# Altium schematic sheet peripherals.SchDoc
size A4; SheetNumber: 2; SheetTotal: 2
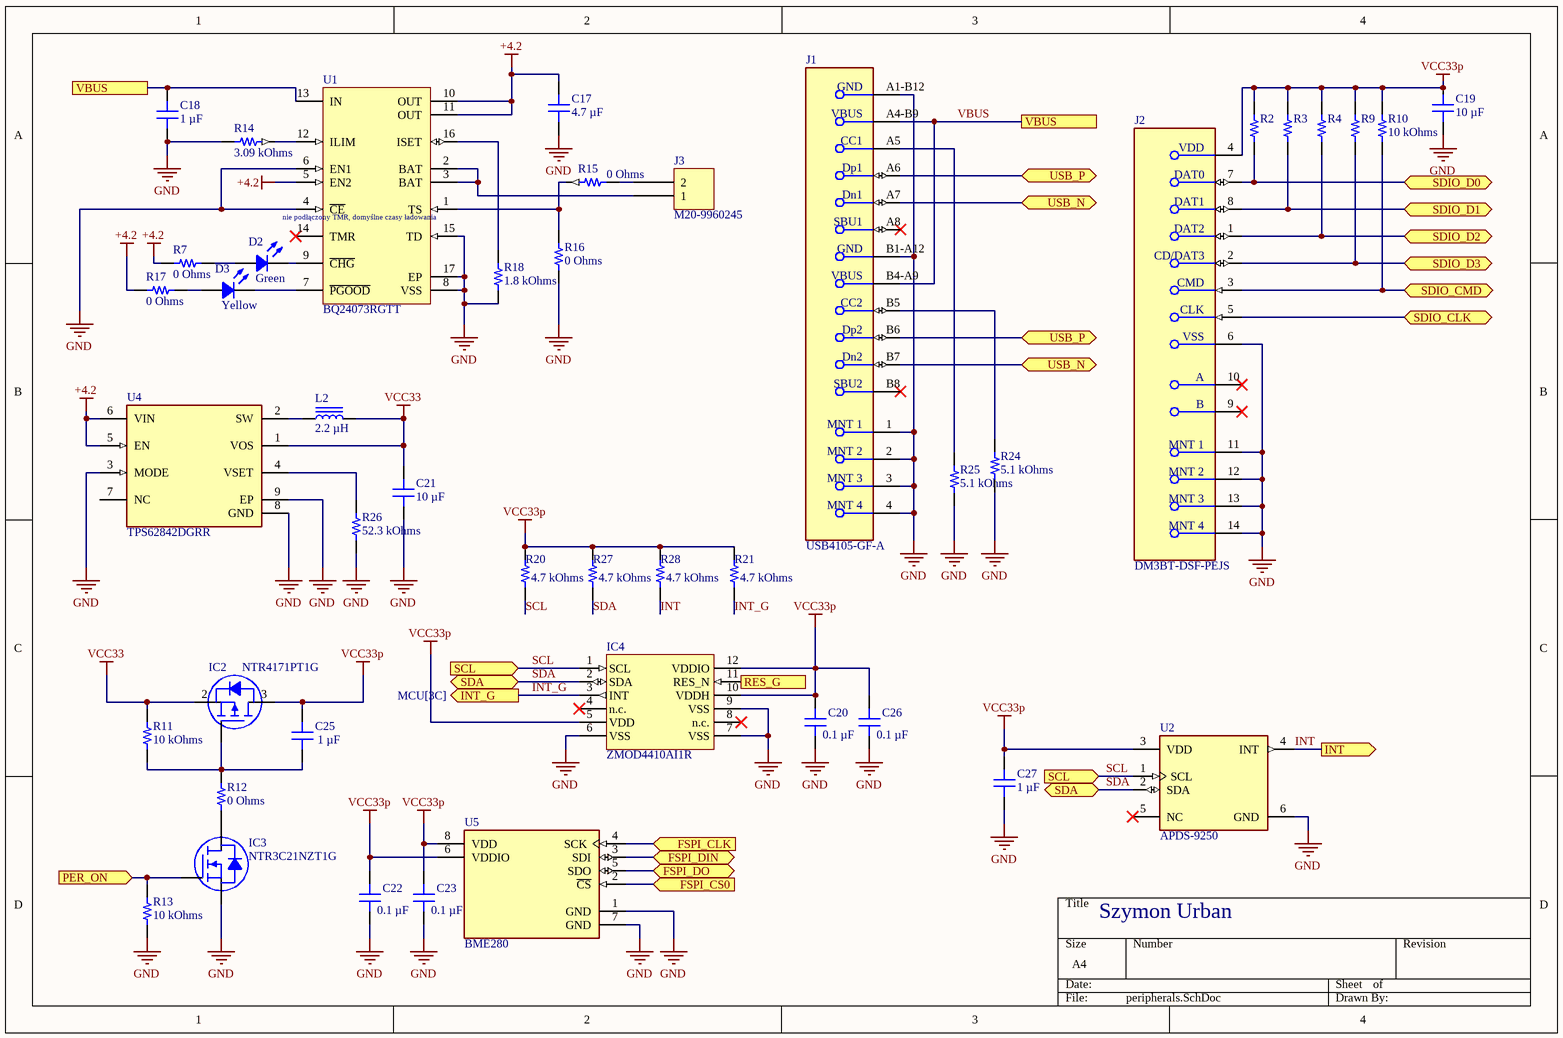
[diagram p0: peripherals.SchDoc]

## Parts
C17  4.7 µF  [CAP 0603_1608]
C18  1 µF  [CAP 0603_1608]
C19  10 µF  [CAP 0603_1608]
C20  0.1 µF  [CAP 0603_1608]
C21  10 µF  [CAP 0603_1608]
C22  0.1 µF  [CAP 0603_1608]
C23  0.1 µF  [CAP 0603_1608]
C25  1 µF  [CAP 0603_1608]
C26  0.1 µF  [CAP 0603_1608]
C27  1 µF  [CAP 0603_1608]
D2  Green  [LED 0805_2012 GREEN]
D3  Yellow  [LED 0805_2012 YELLOW]
IC2  NTR4171PT1G  [ON SEMI SOT-23-3]
IC3  NTR3C21NZT1G  [ON SEMI SOT-23-3]
IC4  ZMOD4410AI1R  [ZMODxxxx 12 Leads- LGG12]
J1  USB4105-GF-A  [FP-USB4105-GF-A-MFG]
J2  DM3BT-DSF-PEJS  [FP-DM3BT-DSF-PEJS-MFG]
J3  M20-9960245  [HARWIN M20-9960245]
L2  2.2 µH  [IND 0806_2016]
R2  10 kOhms  [RES 0603_1608]  (value not drawn)
R3  10 kOhms  [RES 0603_1608]  (value not drawn)
R4  10 kOhms  [RES 0603_1608]  (value not drawn)
R7  0 Ohms  [RES 0603_1608]
R9  10 kOhms  [RES 0603_1608]  (value not drawn)
R10  10 kOhms  [RES 0603_1608]
R11  10 kOhms  [RES 0603_1608]
R12  0 Ohms  [RES 0603_1608]
R13  10 kOhms  [RES 0603_1608]
R14  3.09 kOhms  [RES 0603_1608]
R15  0 Ohms  [RES 0603_1608]
R16  0 Ohms  [RES 0603_1608]
R17  0 Ohms  [RES 0603_1608]
R18  1.8 kOhms  [RES 0603_1608]
R20  4.7 kOhms  [RES 0603_1608]
R21  4.7 kOhms  [RES 0603_1608]
R24  5.1 kOhms  [RES 0603_1608]
R25  5.1 kOhms  [RES 0603_1608]
R26  52.3 kOhms  [RES 0603_1608]
R27  4.7 kOhms  [RES 0603_1608]
R28  4.7 kOhms  [RES 0603_1608]
U1  BQ24073RGTT  [RGT0016C_V]
U2  APDS-9250  [FP-APDS-9250-MFG]
U4  TPS62842DGRR  [FP-DGR0008A-MFG]
U5  BME280  [FP-BME280-MFG]

## Ports
FSPI_CLK (in, see MCU[1D]), FSPI_CS0 (in, see MCU[3C]), FSPI_DIN (bidir, see MCU[1C]), FSPI_DO (bidir, see MCU[1D]), INT (out, see MCU[1D]), INT_G (out, see MCU[3C]), PER_ON (in, see MCU[3C]), RES_G (in, see MCU[3C]), SCL (in, see MCU[1D], peripherals[2C]), SCL (in, see MCU[1D], peripherals[3D]), SDA (bidir, see MCU[1D], peripherals[2C]), SDA (bidir, see MCU[1D], peripherals[3D]), SDIO_CLK (bidir, see MCU[3B]), SDIO_CMD (bidir, see MCU[3B]), SDIO_D0 (bidir, see MCU[3B]), SDIO_D1 (bidir, see MCU[3B]), SDIO_D2 (bidir, see MCU[3B]), SDIO_D3 (bidir, see MCU[3A]), USB_N (bidir, see MCU[1D], peripherals[3A]), USB_N (bidir, see MCU[1D], peripherals[3B]), USB_P (bidir, see MCU[3C], peripherals[3A]), USB_P (bidir, see MCU[3C], peripherals[3B]), VBUS (see MCU[1D], peripherals[1A]), VBUS (see MCU[1D], peripherals[3A])

## Nets
+4.2: C17.2 R7.2 R17.2 U1.5(EN2) U1.10(OUT) U1.11(OUT) U4.5(EN) U4.6(VIN)
GND: C17.1 C18.1 C19.2 C20.1 C21.2 C22.1 C23.1 C26.1 C27.1 IC3.2(S) IC4.6(VSS) IC4.7(VSS) IC4.9(VSS) J1.1(MNT_1) J1.2(MNT_2) J1.3(MNT_3) J1.4(MNT_4) J1.A1-B12(GND) J1.B1-A12(GND) J2.6(VSS) J2.11(MNT_1) J2.12(MNT_2) J2.13(MNT_3) J2.14(MNT_4) R13.1 R14.1 R16.1 R18.1 R24.1 R25.1 R26.1 U1.4(~{CE}) U1.6(EN1) U1.8(VSS) U1.15(TD) U1.17(EP) U2.6(GND) U4.3(MODE) U4.8(GND) U4.9(EP) U5.1(GND) U5.7(GND)
VCC33: C21.1 IC2.2(S) L2.2 R11.2 U4.1(VOS)
VCC33p: C19.1 C20.2 C22.2 C23.2 C25.2 C26.2 C27.2 IC2.3(D) IC4.5(VDD) IC4.10(VDDH) IC4.12(VDDIO) J2.4(VDD) R2.2 R3.2 R4.2 R9.2 R10.2 R20.1 R21.1 R27.1 R28.1 U2.3(VDD) U5.6(VDDIO) U5.8(VDD)
FSPI_CLK: U5.4(SCK) ; port FSPI_CLK
FSPI_CS0: U5.2(~{CS}) ; port FSPI_CS0
FSPI_DIN: U5.3(SDI) ; port FSPI_DIN
FSPI_DO: U5.5(SDO) ; port FSPI_DO
INT: R28.2 U2.4(INT) ; port INT
INT_G: IC4.3(INT) R21.2 ; port INT_G
PER_ON: IC3.1(G) R13.2 ; port PER_ON
RES_G: IC4.11(RES_N) ; port RES_G
SCL: IC4.1(SCL) R20.2 U2.1(SCL) ; port SCL
SDA: IC4.2(SDA) R27.2 U2.2(SDA) ; port SDA
SDIO_CLK: J2.5(CLK) ; port SDIO_CLK
SDIO_CMD: J2.3(CMD) R10.1 ; port SDIO_CMD
SDIO_D0: J2.7(DAT0) R2.1 ; port SDIO_D0
SDIO_D1: J2.8(DAT1) R3.1 ; port SDIO_D1
SDIO_D2: J2.1(DAT2) R4.1 ; port SDIO_D2
SDIO_D3: J2.2(CD/DAT3) R9.1 ; port SDIO_D3
USB_N: J1.A7(Dn1) J1.B7(Dn2) ; port USB_N
USB_P: J1.A6(Dp1) J1.B6(Dp2) ; port USB_P
VBUS: C18.2 J1.A4-B9(VBUS) J1.B4-A9(VBUS) U1.13(IN) ; port VBUS
NetC25_1: C25.1 IC2.1(G) R11.1 R12.2
NetD2_1: D2.1 R7.1
NetD2_2: D2.2 U1.9(~{CHG})
NetD3_1: D3.1 R17.1
NetD3_2: D3.2 U1.7(~{PGOOD})
NetIC3_3: IC3.3(D) R12.1
NetJ1_A5: J1.A5(CC1) R25.2
NetJ1_B5: J1.B5(CC2) R24.2
NetJ3_1: J3.1 U1.2(BAT) U1.3(BAT)
NetJ3_2: J3.2 R15.2
NetL2_1: L2.1 U4.2(SW)
NetR14_2: R14.2 U1.12(ILIM)
NetR15_1: R15.1 R16.2 U1.1(TS)
NetR18_2: R18.2 U1.16(ISET)
NetR26_2: R26.2 U4.4(VSET)

Not connected (* = marked no-connect by the designer): IC4 4(n.c.)* 8(n.c.)*; J1 A8(SBU1)* B8(SBU2)*; J2 9(B)* 10(A)*; U1 14(TMR)*; U2 5(NC)*; U4 7(NC)

## Notes on the sheet
- (near U1) nie podłączony TMR, domyślne czasy ładowania
- Szymon Urban

## Library data of the parts
C17 = GRM188R61C475KE11D: CAP CER 4.7UF 16V X5R 0603; manufacturer: Murata Electronics; Tolerance: ±10%; Part Number: GRM188R61C475KE11D; Value: 4.7 µF; Applications: General Purpose; Capacitance: 4.7 µF; componentlink1description: Datasheet; componentlink1url: https://search.murata.co.jp/Ceramy/image/img/A01X/G101/ENG/GRM188R61C475KE11-01.pdf; componentlink2description: DigiKey Link; componentlink2url: https://www.digikey.com/en/products/detail/murata-electronics/GRM188R61C475KE11D/4905341; Device Package: 0603 (1608 Metric); lastupdated: 15.01.2024 20:10:04; Lifecycle Status: Active; Minimum Order: 1; Mounting Type: Surface Mount, MLCC; Operating Temperature: -55°C ~ 85°C; Package / Case: 0603 (1608 Metric); packaging: TapeAndReel; partid: 2388; Part Status: Active; price: 0.03; series: GRM; Size / Dimension: 0.063" L x 0.031" W (1.60mm x 0.80mm); Supplier 1: DigiKey; Supplier Part Number 1: 490-10730-1-ND; Temperature Coefficient: X5R; Thickness (Max): 0.037" (0.95mm); Voltage - Rated: 16V
C18 C25 C27 = CC0603KRX7R6BB105: CAP CER 1UF 10V X7R 0603; manufacturer: Yageo; Tolerance: ±10%; Part Number: CC0603KRX7R6BB105; Value: 1 µF; Applications: General Purpose; Capacitance: 1 µF; componentlink1description: Datasheet; componentlink1url: https://www.yageo.com/upload/media/product/productsearch/datasheet/mlcc/UPY-GPHC_X7R_6.3V-to-50V_18.pdf; componentlink2description: DigiKey Link; componentlink2url: https://www.digikey.com/en/products/detail/yageo/CC0603KRX7R6BB105/5195204; Device Package: 0603 (1608 Metric); lastupdated: 15.01.2024 20:10:05; Lifecycle Status: Active; Minimum Order: 1; Mounting Type: Surface Mount, MLCC; Operating Temperature: -55°C ~ 125°C; Package / Case: 0603 (1608 Metric); packaging: TapeAndReel; partid: 2290; Part Status: Active; price: 0.01; series: CC; Size / Dimension: 0.063" L x 0.031" W (1.60mm x 0.80mm); Supplier 1: DigiKey; Supplier Part Number 1: 311-1796-1-ND; Temperature Coefficient: X7R; Thickness (Max): 0.035" (0.90mm); Voltage - Rated: 10V
C19 C21 = GRM188D71A106KA73D: CAP CER 10UF 10V X7T 0603; manufacturer: Murata Electronics; Tolerance: ±10%; Part Number: GRM188D71A106KA73D; Value: 10 µF; Applications: General Purpose; Capacitance: 10 µF; componentlink1description: Datasheet; componentlink1url: https://search.murata.co.jp/Ceramy/image/img/A01X/G101/ENG/GRM188D71A106KA73-01.pdf; componentlink2description: DigiKey Link; componentlink2url: https://www.digikey.com/en/products/detail/murata-electronics/GRM188D71A106KA73D/6606090; Device Package: 0603 (1608 Metric); lastupdated: 15.01.2024 20:10:04; Lifecycle Status: Active; Minimum Order: 1; Mounting Type: Surface Mount, MLCC; Operating Temperature: -55°C ~ 125°C; Package / Case: 0603 (1608 Metric); packaging: TapeAndReel; partid: 2489; Part Status: Active; price: 0.03; series: GRM; Size / Dimension: 0.063" L x 0.031" W (1.60mm x 0.80mm); Supplier 1: DigiKey; Supplier Part Number 1: 490-14461-1-ND; Temperature Coefficient: X7T; Thickness (Max): 0.039" (1.00mm); Voltage - Rated: 10V
C20 C22 C23 C26 = CS0603KRX7R7BB104: CAP CER 0.1UF 16V X7R 0603; manufacturer: Yageo; Tolerance: ±10%; Part Number: CS0603KRX7R7BB104; Value: 0.1 µF; Applications: Boardflex Sensitive; Capacitance: 0.1 µF; componentlink1description: Datasheet; componentlink1url: http://www.yageo.com/NewPortal/yageodocoutput?fileName=/pdf/MLCC/UPY-ST_NPOX7R_16V-to-3KV_5.pdf; componentlink2description: DigiKey Link; componentlink2url: https://www.digikey.com/en/products/detail/yageo/CS0603KRX7R7BB104/6097897; Device Package: 0603 (1608 Metric); Features: Soft Termination; lastupdated: 15.01.2024 20:10:05; Lifecycle Status: Active; Minimum Order: 1; Mounting Type: Surface Mount, MLCC; Operating Temperature: -55°C ~ 125°C; Package / Case: 0603 (1608 Metric); packaging: TapeAndReel; partid: 2286; Part Status: Active; price: 0.01; series: CS; Size / Dimension: 0.063" L x 0.031" W (1.60mm x 0.80mm); Supplier 1: DigiKey; Supplier Part Number 1: 311-3560-1-ND; Temperature Coefficient: X7R; Thickness (Max): 0.037" (0.95mm); Voltage - Rated: 16V
D2 = 150080VS75000: LED GREEN CLEAR 0805 SMD; Manufacturer: Würth Elektronik; Configuration: Standard; Current - Test: 20mA; Lens Color: Colorless; Lens Size: 1.40mm x 1.25mm; Lens Style: Rectangle with Flat Top; Millicandela Rating: 40mcd; Viewing Angle: 140°; Voltage - Forward (Vf) (Typ): 2V; Wavelength - Dominant: 570nm; Wavelength - Peak: 572nm; Part Number: 150080VS75000; Color: Green; ComponentLink1Description: Datasheet; ComponentLink1URL: https://katalog.we-online.de/led/datasheet/150080VS75000.pdf; ComponentLink2Description: DigiKey Link; ComponentLink2URL: https://www.digikey.com/en/products/detail/würth-elektronik/150080VS75000/4489924; Device Package: 0805 (2012 Metric); Height (Max): 0.80mm; LastUpdated: 15.01.2024 21:31:06; Lens Transparency: Clear; Lifecycle Status: Active; Minimum Order: 1; Mounting Type: Surface Mount; Package / Case: 0805 (2012 Metric); Packaging: TapeAndReel; PartId: 300; Part Status: Active; Price: 0.13; Series: WL-SMCW; Size / Dimension: 2.00mm L x 1.25mm W; Supplier 1: DigiKey; Supplier Part Number 1: 732-4986-1-ND; Supplier Device Package: 0805; Value: Green
D3 = 150080YS75000: LED YELLOW CLEAR 0805 SMD; Manufacturer: Würth Elektronik; Configuration: Standard; Current - Test: 20mA; Lens Color: Colorless; Lens Size: 1.40mm x 1.25mm; Lens Style: Rectangle with Flat Top; Millicandela Rating: 120mcd; Viewing Angle: 140°; Voltage - Forward (Vf) (Typ): 2V; Wavelength - Dominant: 590nm; Wavelength - Peak: 595nm; Part Number: 150080YS75000; Color: Yellow; ComponentLink1Description: Datasheet; ComponentLink1URL: https://katalog.we-online.de/led/datasheet/150080YS75000.pdf; ComponentLink2Description: DigiKey Link; ComponentLink2URL: https://www.digikey.com/en/products/detail/würth-elektronik/150080YS75000/4489927; Device Package: 0805 (2012 Metric); Height (Max): 0.80mm; LastUpdated: 15.01.2024 21:32:02; Lens Transparency: Clear; Lifecycle Status: Active; Minimum Order: 1; Mounting Type: Surface Mount; Package / Case: 0805 (2012 Metric); Packaging: TapeAndReel; PartId: 56; Part Status: Active; Price: 0.13; Series: WL-SMCW; Size / Dimension: 2.00mm L x 1.25mm W; Supplier 1: DigiKey; Supplier Part Number 1: 732-4987-1-ND; Supplier Device Package: 0805; Value: Yellow
IC2 = NTR4171PT1G: MOSFET P-CH 30V 2.2A SOT23; Manufacturer: ON Semiconductor; Current - Continuous Drain (Id) @ 25°C: 2.2A (Ta); Drive Voltage (Max Rds On,  Min Rds On): 2.5V, 10V; FET Type: P-Channel; Gate Charge (Qg) (Max) @ Vgs: 15.6nC @ 10V; Input Capacitance (Ciss) (Max) @ Vds: 720pF @ 15V; Power Dissipation (Max): 480mW (Ta); Rds On (Max) @ Id, Vgs: 75mOhm @ 2.2A, 10V; Vgs (Max): ±12V; Vgs(th) (Max) @ Id: 1.4V @ 250µA; Part Number: NTR4171PT1G; ComponentLink1Description: Datasheet; ComponentLink1URL: http://www.onsemi.com/pub/Collateral/NTR4171P-D.PDF; ComponentLink2Description: DigiKey Link; ComponentLink2URL: http://digikey.com/product-detail/en/on-semiconductor/NTR4171PT1G/NTR4171PT1GOSCT-ND/2705209; Drain to Source Voltage (Vdss): 30V; LastUpdated: 08.02.2024 21:46:19; Lifecycle Status: Active; Minimum Order: 1; Mounting Type: Surface Mount; Operating Temperature: -55°C ~ 150°C (TJ); Package / Case: TO-236-3, SC-59, SOT-23-3; Packaging: TapeAndReel; Part Status: Active; Price: 0.10; Series: -; Supplier 1: DigiKey; Supplier Part Number 1: NTR4171PT1GOSCT-ND; Supplier Device Package: SOT-23-3 (TO-236); Technology: MOSFET (Metal Oxide)
IC3 = NTR3C21NZT1G: MOSFET N-CH 20V 3.6A SOT23-3; Manufacturer: ON Semiconductor; Current - Continuous Drain (Id) @ 25°C: 3.6A (Ta); Drive Voltage (Max Rds On,  Min Rds On): 1.8V, 4.5V; FET Type: N-Channel; Gate Charge (Qg) (Max) @ Vgs: 17.8nC @ 4.5V; Input Capacitance (Ciss) (Max) @ Vds: 1540pF @ 16V; Power Dissipation (Max): 470mW (Ta); Rds On (Max) @ Id, Vgs: 24mOhm @ 5A, 4.5V; Vgs (Max): ±8V; Vgs(th) (Max) @ Id: 1V @ 250µA; Part Number: NTR3C21NZT1G; ComponentLink1Description: Datasheet; ComponentLink1URL: http://www.onsemi.com/pub/Collateral/NTR3C21NZ-D.PDF; ComponentLink2Description: DigiKey Link; ComponentLink2URL: http://digikey.com/product-detail/en/on-semiconductor/NTR3C21NZT1G/NTR3C21NZT1GOSCT-ND/9087577; Drain to Source Voltage (Vdss): 20V; LastUpdated: 08.02.2024 21:46:18; Lifecycle Status: Active; Minimum Order: 1; Mounting Type: Surface Mount; Operating Temperature: -55°C ~ 150°C (TJ); Package / Case: TO-236-3, SC-59, SOT-23-3; Packaging: TapeAndReel; Part Status: Active; Price: 0.10; Series: -; Supplier 1: DigiKey; Supplier Part Number 1: NTR3C21NZT1GOSCT-ND; Supplier Device Package: SOT-23-3 (TO-236); Technology: MOSFET (Metal Oxide)
IC4 = CMP-13577-000002-2: TVOC IAQ INTEGRATED SENSOR; NexarPartId: 106944004; Min Supply Voltage: 1.7V; Max Supply Voltage: 3.6V; Width: 3mm; Min Operating Temperature: -40°C; Max Operating Temperature: 65°C; RoHS: Non-Compliant; Height: 770µm; Thickness: 700µm; Length: 3mm; Ambient Temperature Range High: 65°C; Number of Pins: 12
J1 = CMP-245163-000001-1: CONN RCPT USB2.0 TYPEC 5A; Manufacturer: GCT; Voltage Rating: 20V; Is Female: yes; Current Rating: 5/6.25/1.25/0.25A; Number Of Contacts: 16; Conn Orientation: Right Angle; Device Class L1: Connectors; Category: Conn; Lead Free: Yes; RoHS: TRUE; Temperature Range High: +85°C; Digikey Description: CONN RCPT USB2.0 TYPEC 5A; Device Class L3: unset; ComponentLink2Description: Datasheet; Manufacturer Part Number: USB4105-GF-A; Package: 0; Usb Standard: USB 2.0; Device Class L2: USB Connectors; Automotive: No; Temperature Range Low: -40°C; Height: 3.46mm; Temperature: -40°C to +85°C; Contact Material: Gold,Nickel; ComponentLink2URL: https://gct.co/files/drawings/usb4105.pdf; Octopart: https://octopart.com/usb4105-gf-a-gct-106627878
J2 = CMP-11597-000004-1: CONN MICRO SD CARD PUSH-PUSH R/A; Connector Type: Connector; Pitch: 1.1mm; Insulation Resistance: 1GR; Contact Resistance: 100mR; Number of Positions: 8; Max Voltage Rating (AC): 125V; Gender: Female; Current Rating: 500mA; Flammability Rating: UL94 V-0; Min Operating Temperature: -25°C; Lead Free: Lead Free; Length: 13.85mm; Radiation Hardening: No; Orientation: Right Angle; Mount: Surface Mount; Housing Material: Polymer; Contact Material: Copper Alloy; Package Quantity: 1; Contact Plating: Gold; Termination: Solder; Max Operating Temperature: 85°C; Number of Contacts: 8; Voltage Rating (AC): 125V; REACH SVHC: No SVHC; Depth: 1.83mm; Max Current Rating: 500mA; Width: 16.05mm; Number of Rows: 1; Packaging: Tape and Reel
J3 = M20-9960245: CONN HEADER R/A 2POS 2.54MM; Manufacturer: Harwin Inc.; Connector Type: Header, Cuttable; Contact Length - Mating: 0.240" (6.10mm); Contact Length - Post: 0.118" (3.00mm); Current Rating (Amps): 3A per Contact; Material Flammability Rating: UL94 V-0; Number of Positions: 2; Number of Positions Loaded: All; Pitch - Mating: 0.100" (2.54mm); Row Spacing - Mating: -40°C ~ 105°C; Shrouding: Unshrouded; Style: Board to Board or Cable; Part Number: M20-9960245; ComponentLink1Description: Datasheet; ComponentLink1URL: https://cdn.harwin.com/pdfs/Harwin_PC_Connectors_M20.pdf; ComponentLink2Description: DigiKey Link; ComponentLink2URL: https://www.digikey.com/en/products/detail/harwin-inc/M20-9960245/3728208; Contact Finish - Mating: Gold; Contact Material: Brass; Contact Shape: Square; Contact Type: Male Pin; Fastening Type: Push-Pull; Insulation Color: Black; Insulation Height: 0.100" (2.54mm); Insulation Material: Polyamide (PA6T), Nylon 6T; LastUpdated: 21.09.2022 19:22:55; Lifecycle Status: Active; Minimum Order: 1; Mounting Type: Through Hole, Right Angle; Number of Rows: 1; Operating Temperature: -40°C ~ 105°C; Packaging: Bulk; PartId: 165; Part Status: Active; Price: 0.07; Series: M20; Supplier 1: DigiKey; Supplier Part Number 1: 952-2244-ND; Termination: Solder
L2 = DFE201612E-2R2M=P2: FIXED IND 2.2UH 1.8A 116MOHM SMD; Manufacturer: Murata Electronics; DC Resistance (DCR): 116mOhm Max; Inductance Frequency - Test: 1 MHz; Material - Core: Metal; Shielding: Shielded; Tolerance: ±20%; Type: Drum Core, Wirewound; Part Number: DFE201612E-2R2M=P2; ComponentLink1Description: Datasheet; ComponentLink1URL: https://search.murata.co.jp/Ceramy/image/img/P02/J(E)TE243A-0006.pdf; ComponentLink2Description: DigiKey Link; ComponentLink2URL: https://www.digikey.com/en/products/detail/murata-electronics/DFE201612E-2R2M-P2/9815901; Current Rating (Amps): 1.8 A; Device Package: 0806 (2016 Metric); Height - Seated (Max): 0.047" (1.20mm); Inductance: 2.2 µH; LastUpdated: 08.02.2024 21:45:16; Lifecycle Status: Active; Minimum Order: 1; Mounting Type: Surface Mount; Operating Temperature: -40°C ~ 125°C; Package / Case: 0806 (2016 Metric); Packaging: TapeAndReel; PartId: 5399; Part Status: Active; Price: 0.11; Series: DFE201612E; Size / Dimension: 0.079" L x 0.063" W (2.00mm x 1.60mm); Supplier 1: DigiKey; Supplier Part Number 1: 490-DFE201612E-2R2M=P2CT-ND; Supplier Device Package: 0806; Value: 2.2 µH
R2-R4 R9 R10 = RT0603FRE0710KL: RES SMD 10K OHM 1% 1/10W 0603; Manufacturer: Yageo; Power (Watts): 0.1W, 1/10W; Temperature Coefficient: ±50ppm/°C; Part Number: RT0603FRE0710KL; Value: 10 kOhms; ComponentLink1Description: Datasheet; ComponentLink1URL: https://www.yageo.com/upload/media/product/productsearch/datasheet/rchip/PYu-RT_1-to-0.01_RoHS_L_11.pdf; ComponentLink2Description: DigiKey Link; ComponentLink2URL: https://www.digikey.com/en/products/detail/yageo/RT0603FRE0710KL/1075040; Composition: Thin Film; Device Package: 0603 (1608 Metric); Height - Seated (Max): 0.022" (0.55mm); LastUpdated: 15.01.2024 20:40:25; Lifecycle Status: Active; Minimum Order: 1; Number of Terminations: 2; Operating Temperature: -55°C ~ 155°C; Package / Case: 0603 (1608 Metric); Packaging: TapeAndReel; PartId: 5671; Part Status: Active; Price: 0.01; Resistance: 10 kOhms; Series: RT; Size / Dimension: 0.063" L x 0.031" W (1.60mm x 0.80mm); Supplier 1: DigiKey; Supplier Part Number 1: YAG2321CT-ND; Supplier Device Package: 0603; Tolerance: ±1%
R7 R12 R15-R17 = JR0603X26E: 0603 26 AMP JUMPER; Manufacturer: Ohmite; Power (Watts): 0.135W; Part Number: JR0603X26E; Value: 0 Ohms; ComponentLink1Description: Datasheet; ComponentLink1URL: https://www.ohmite.com/assets/docs/res_jr.pdf?r=false; ComponentLink2Description: DigiKey Link; ComponentLink2URL: https://www.digikey.com/en/products/detail/ohmite/JR0603X26E/10233371; Composition: Metal Element; Device Package: 0603 (1608 Metric); Height - Seated (Max): 0.022" (0.55mm); LastUpdated: 15.01.2024 20:40:20; Lifecycle Status: Active; Minimum Order: 1; Number of Terminations: 2; Operating Temperature: -55°C ~ 150°C; Package / Case: 0603 (1608 Metric); Packaging: TapeAndReel; PartId: 6812; Part Status: Active; Price: 0.10; Resistance: 0 Ohms; Series: JR; Size / Dimension: 0.063" L x 0.031" W (1.60mm x 0.80mm); Supplier 1: DigiKey; Supplier Part Number 1: JR0603X26ECT-ND; Supplier Device Package: 0603; Tolerance: Jumper
R11 R13 = TNPW060310K0FHTA: RES 10K OHM 1% 1/10W 0603; Manufacturer: Vishay Dale; Power (Watts): 0.1W, 1/10W; Temperature Coefficient: ±50ppm/°C; Part Number: TNPW060310K0FHTA; Value: 10 kOhms; ComponentLink2Description: DigiKey Link; ComponentLink2URL: https://www.digikey.com/en/products/detail/vishay-dale/TNPW060310K0FHTA/7354881; Composition: Thin Film; Device Package: 0603 (1608 Metric); Features: Military; Height - Seated (Max): 0.022" (0.55mm); LastUpdated: 09.02.2024 20:43:19; Lifecycle Status: Active; Minimum Order: 1; Number of Terminations: 2; Operating Temperature: -55°C ~ 125°C; Package / Case: 0603 (1608 Metric); Packaging: TapeAndReel; PartId: 9361; Part Status: Active; Price: 0.09; Resistance: 10 kOhms; Series: TNPW; Size / Dimension: 0.063" L x 0.033" W (1.60mm x 0.85mm); Supplier 1: DigiKey; Supplier Part Number 1: 541-3906-1-ND; Supplier Device Package: 0603; Tolerance: ±1%
R14 = RMCF0603FT3K09: RES 3.09K OHM 1% 1/10W 0603; Manufacturer: Stackpole Electronics Inc; Power (Watts): 0.1W, 1/10W; Temperature Coefficient: ±100ppm/°C; Part Number: RMCF0603FT3K09; Value: 3.09 kOhms; ComponentLink1Description: Datasheet; ComponentLink1URL: https://www.seielect.com/catalog/sei-rmcf_rmcp.pdf; ComponentLink2Description: DigiKey Link; ComponentLink2URL: https://www.digikey.com/en/products/detail/stackpole-electronics-inc/RMCF0603FT3K09/1761340; Composition: Thick Film; Device Package: 0603 (1608 Metric); Features: Automotive AEC-Q200; Height - Seated (Max): 0.022" (0.55mm); LastUpdated: 15.01.2024 20:39:25; Lifecycle Status: Active; Minimum Order: 1; Number of Terminations: 2; Operating Temperature: -55°C ~ 155°C; Package / Case: 0603 (1608 Metric); Packaging: CutTape; PartId: 20368; Part Status: Active; Price: 0.01; Ratings: AEC-Q200; Resistance: 3.09 kOhms; Series: RMCF; Size / Dimension: 0.061" L x 0.031" W (1.55mm x 0.80mm); Supplier 1: DigiKey; Supplier Part Number 1: RMCF0603FT3K09CT-ND; Supplier Device Package: 0603; Tolerance: ±1%
R18 = RMCF0603JG1K80: RES 1.8K OHM 5% 1/10W 0603; Manufacturer: Stackpole Electronics Inc; Power (Watts): 0.1W, 1/10W; Temperature Coefficient: ±200ppm/°C; Part Number: RMCF0603JG1K80; Value: 1.8 kOhms; ComponentLink1Description: Datasheet; ComponentLink1URL: https://www.seielect.com/catalog/sei-packaging.pdf; ComponentLink2Description: DigiKey Link; ComponentLink2URL: https://www.digikey.com/en/products/detail/stackpole-electronics-inc/RMCF0603JG1K80/1712125; Composition: Thick Film; Device Package: 0603 (1608 Metric); Features: Automotive AEC-Q200; Height - Seated (Max): 0.022" (0.55mm); LastUpdated: 15.01.2024 20:39:16; Lifecycle Status: Active; Minimum Order: 1; Number of Terminations: 2; Operating Temperature: -55°C ~ 155°C; Package / Case: 0603 (1608 Metric); Packaging: CutTape; PartId: 22440; Part Status: Active; Price: 0.01; Ratings: AEC-Q200; Resistance: 1.8 kOhms; Series: RMCF; Size / Dimension: 0.061" L x 0.031" W (1.55mm x 0.80mm); Supplier 1: DigiKey; Supplier Part Number 1: RMCF0603JG1K80CT-ND; Supplier Device Package: 0603; Tolerance: ±5%
R20 R21 R27 R28 = TNPW06034K70BEEN: RES 4.7K OHM 0.1% 1/10W 0603; Manufacturer: Vishay Dale; Power (Watts): 0.1W, 1/10W; Temperature Coefficient: ±25ppm/°C; Part Number: TNPW06034K70BEEN; Value: 4.7 kOhms; ComponentLink1Description: Datasheet; ComponentLink1URL: http://www.vishay.com/docs/28758/tnpw_e3.pdf; ComponentLink2Description: DigiKey Link; ComponentLink2URL: https://www.digikey.com/en/products/detail/vishay-dale/TNPW06034K70BEEN/1610049; Composition: Thin Film; Device Package: 0603 (1608 Metric); Features: Anti-Sulfur, Automotive AEC-Q200, Moisture Resistant; Height - Seated (Max): 0.022" (0.55mm); LastUpdated: 09.02.2024 20:42:39; Lifecycle Status: Active; Minimum Order: 1; Number of Terminations: 2; Operating Temperature: -55°C ~ 155°C; Package / Case: 0603 (1608 Metric); Packaging: TapeAndReel; PartId: 19608; Part Status: Active; Price: 0.14; Ratings: AEC-Q200; Resistance: 4.7 kOhms; Series: TNPW e3; Size / Dimension: 0.063" L x 0.033" W (1.60mm x 0.85mm); Supplier 1: DigiKey; Supplier Part Number 1: 541-3689-1-ND; Supplier Device Package: 0603; Tolerance: ±0.1%
R24 R25 = RR0816P-512-D: RES SMD 5.1K OHM 0.5% 1/16W 0603; Manufacturer: Susumu; Power (Watts): 0.063W, 1/16W; Temperature Coefficient: ±25ppm/°C; Part Number: RR0816P-512-D; Value: 5.1 kOhms; ComponentLink1Description: Datasheet; ComponentLink1URL: http://www.susumu.co.jp/common/pdf/n_catalog_partition05_en.pdf; ComponentLink2Description: DigiKey Link; ComponentLink2URL: https://www.digikey.com/en/products/detail/susumu/RR0816P-512-D/432202; Composition: Thin Film; Device Package: 0603 (1608 Metric); Height - Seated (Max): 0.020" (0.50mm); LastUpdated: 15.01.2024 20:39:40; Lifecycle Status: Active; Minimum Order: 1; Number of Terminations: 2; Operating Temperature: -55°C ~ 125°C; Package / Case: 0603 (1608 Metric); Packaging: TapeAndReel; PartId: 16877; Part Status: Active; Price: 0.01; Resistance: 5.1 kOhms; Series: RR; Size / Dimension: 0.063" L x 0.031" W (1.60mm x 0.80mm); Supplier 1: DigiKey; Supplier Part Number 1: RR08P5.1KDCT-ND; Supplier Device Package: 0603; Tolerance: ±0.5%
R26 = RC0603FR-1052K3L: RES 52.3K OHM 1% 1/10W 0603; Manufacturer: Yageo; Power (Watts): 0.1W, 1/10W; Temperature Coefficient: ±100ppm/°C; Part Number: RC0603FR-1052K3L; Value: 52.3 kOhms; ComponentLink1Description: Datasheet; ComponentLink1URL: https://www.yageo.com/upload/media/product/productsearch/datasheet/rchip/PYu-RC_Group_51_RoHS_L_11.pdf; ComponentLink2Description: DigiKey Link; ComponentLink2URL: https://www.digikey.com/en/products/detail/yageo/RC0603FR-1052K3L/14008206; Composition: Thick Film; Device Package: 0603 (1608 Metric); Height - Seated (Max): 0.022" (0.55mm); LastUpdated: 15.01.2024 20:38:08; Lifecycle Status: Active; Minimum Order: 1; Number of Terminations: 2; Operating Temperature: -55°C ~ 155°C; Package / Case: 0603 (1608 Metric); Packaging: CutTape; PartId: 65325; Part Status: Active; Price: 0.01; Resistance: 52.3 kOhms; Series: RC_L; Size / Dimension: 0.063" L x 0.031" W (1.60mm x 0.80mm); Supplier 1: DigiKey; Supplier Part Number 1: 13-RC0603FR-1052K3LCT-ND; Supplier Device Package: 0603; Tolerance: ±1%
U1 = CMP-0321-00214-2: USB-Friendly Li-Ion Battery Charger and Power-Path Management IC, Vout 4.4 V, 4.3 V, -40 to 85 degC, 16-pin QFN (RGT), Green (RoHS & no Sb/Br); Manufacturer: Texas Instruments; Over Voltage Protection: N; SubFamily: Battery Charge Management; Vin(Min)(V): 4.3; Mounting Technology: Surface Mount; Lead Acid: N; NiCd: N; Eco-Plan: Green (RoHS & no Sb/Br); Code_JEDEC: MO-220; ComponentLink1Description: Datasheet; DatasheetVersion: SLUS810G; NiMH: N; PackageReference: RGT0016C; PartNumber: BQ24073RGTT; ComponentLink1URL: http://www.ti.com/general/docs/lit/getliterature.tsp?genericPartNumber=BQ24073&fileType=pdf; PackageDescription: 16-Pin Plastic Quad Flat No-Lead, 3 x 3 mm Body, 0.5 mm Pitch, 1.7 x 1.7 mm Exposed Pad; Li-Polymer: N; PackageVersion: revH, Oct-2011; Li-Ion: N
U2 = CMP-18409-000003-1: SENSOR OPT 550NM AMBIENT 6SMD; Manufacturer: Broadcom; Sensor Output: I2C; Max Supply Voltage: 3.6V; Min Supply Voltage: 1.7V; Operating Supply Current: 130uA; Height: 0.75mm; Mouser Description: Digital RGB IR and Ambient Light Sensor with I2C Output; Ambient Temperature Range Low: -40°C; Temperature: -40°C to +85°C; Lead Free: Yes; Temperature Range High: +85°C; Device Class L3: unset; Package: 0; ComponentLink2URL: https://docs.broadcom.com/doc/AV02-4733EN; Ambient Temperature Range High: +85°C; Temperature Range Low: -40°C; Octopart: https://octopart.com/apds-9250-broadcom-71127178; Device Class L1: Sensors; Automotive: No; RoHS: TRUE; Ipc Land Pattern Name: DFN200X200X65-6; Digikey Description: SENSOR OPT 550NM AMBIENT 6SMD; ComponentLink2Description: Datasheet; Category: IC; Device Class L2: Optical Sensors; Manufacturer Part Number: APDS-9250
U4 = CMP-04918-000211-1: STEP DOWN CONVERTER; RoHS Compliant: Yes
U5 = CMP-2000-05073-3: SENSOR PRESSURE HUMIDITY TEMP; Sensor Type: Temperature; Accuracy: 3%; Response Time: 1s; Output Type: SPI; Min Operating Temperature: -40°C; Max Operating Temperature: 85°C; Case/Package: LGA; Packaging: Cut Tape; Mount: Surface Mount; Lead Free: Lead Free; Number of Pins: 8